# Altium schematic sheet MotorDriver.SchDoc
size A4; SheetNumber: 5; SheetTotal: 11
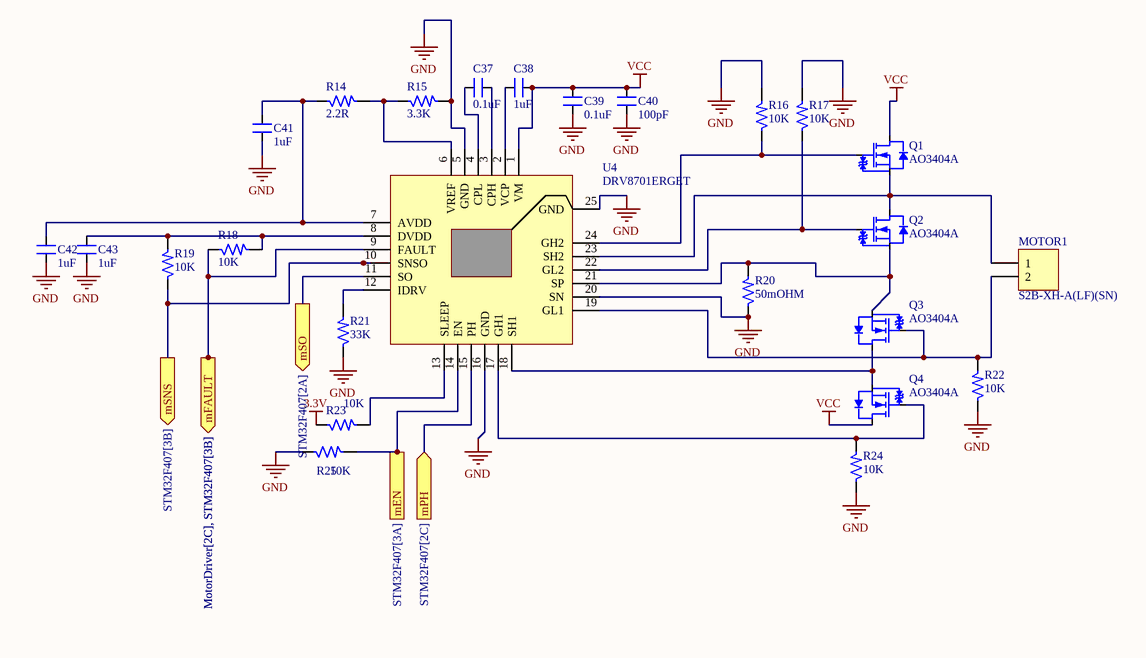
[diagram p0: MotorDriver.SchDoc]

## Parts
C37  0.1uF  [CAP_0805]
C38  1uF  [CAP_0805]
C39  0.1uF  [CAP_0805]
C40  100pF  [CAP_0805]
C41  1uF  [CAP_0805]
C42  1uF  [CAP_0805]
C43  1uF  [CAP_0805]
MOTOR1  S2B-XH-A(LF)(SN)  [CON2_100_S2B-XH-A_TH_RA]
Q1  AO3404A  [SOT 23-3]
Q2  AO3404A  [SOT 23-3]
Q3  AO3404A  [SOT 23-3]
Q4  AO3404A  [SOT 23-3]
R14  2.2R  [RES_0603]
R15  3.3K  [RES_0805]
R16  10K  [RES_0805]
R17  10K  [RES_0805]
R18  10K  [RES_0805]
R19  10K  [RES_0805]
R20  50mOHM  [RES_2512]
R21  33K  [RES_0805]
R22  10K  [RES_0805]
R23  10K  [RES_0805]
R24  10K  [RES_0805]
R25  10K  [RES_0805]
U4  DRV8701ERGET  [VFQFN24_19.6_196_12X32_SMD_1]

## Ports
mEN (in, see STM32F407[3A]), mFAULT (out, see MotorDriver[2C], STM32F407[3B]), mPH (in, see STM32F407[2C]), mSNS (out, see STM32F407[3B]), mSO (out, see STM32F407[2A])

## Nets
3.3V: R23.1
GND: C39.1 C40.1 C41.1 C42.1 C43.1 R15.2 R16.2 R17.2 R20.1 R21.1 R22.1 R24.1 R25.1 U4.5(GND) U4.16(GND) U4.20(SN) U4.25(GND)
VCC: C38.1 C39.2 C40.2 Q1.3(D) Q4.3(D) U4.1(VM)
mEN: R25.2 U4.14(EN) ; port mEN
mFAULT: R18.1 U4.9(FAULT) ; port mFAULT
mPH: U4.15(PH) ; port mPH
mSNS: R19.1 U4.10(SNSO) ; port mSNS
mSO: U4.11(SO) ; port mSO
NetC37_1: C37.1 U4.3(CPH)
NetC37_2: C37.2 U4.4(CPL)
NetC38_2: C38.2 U4.2(VCP)
NetC41_2: C41.2 C42.2 R14.1 U4.7(AVDD)
NetC43_2: C43.2 R18.2 R19.2 U4.8(DVDD)
NetMOTOR1_1: MOTOR1.1 Q1.2(S) Q2.3(D) U4.23(SH2)
NetMOTOR1_2: MOTOR1.2 Q3.1(G) R22.2 U4.19(GL1)
NetQ1_1: Q1.1(G) R16.1 U4.24(GH2)
NetQ2_1: Q2.1(G) R17.1 U4.22(GL2)
NetQ2_2: Q2.2(S) Q3.2(S) R20.2 U4.21(SP)
NetQ3_3: Q3.3(D) Q4.2(S) U4.18(SH1)
NetQ4_1: Q4.1(G) R24.2 U4.17(GH1)
NetR14_2: R14.2 R15.1 U4.6(VREF)
NetR21_2: R21.2 U4.12(IDRV)
NetR23_2: R23.2 U4.13(SLEEP)

## Library data of the parts
C37 C39 = CAP_0.1uF-50V-20%-0805: 0.1µF ±20% 50V Ceramic Capacitor X7R 0805 (2012 Metric); Manufacturer: Samsung Electro-Mechanics; Manufacturer Part Number: CL21B104MBCNNNC; Alternate Part Number-1: NA; Case/Package: 0805; Supplier-1: SIRICOM; Supplier Part Number-1: 0805B104K500CT
C38 C41-C43 = CAP_1uF-50V-5%-0805: 1µF ±5% 50V Ceramic Capacitor X7R 0805 (2012 Metric); Manufacturer: Samsung; Manufacturer Part Number: CC0805JKX7R9BB105; Alternate Part Number-1: 0805F105M500NT; Case/Package: 0805; Supplier-1: SIRICOM; Supplier Part Number-1: CL21B105KBFNNNE
C40 = CAP_100pF-100V-5%-0805: 100pF ±5% 100V Ceramic Capacitor C0G, NP0 0805 (2012 Metric); Manufacturer: Murata; Manufacturer Part Number: CL21C101JC61PNC; Alternate Part Number-1: NA; Case/Package: 0805; Supplier-1: SIRICOM; Supplier Part Number-1: 0805N101J101CT
MOTOR1 = CON-PLG_2X1-100-RA-TH: 2 Pins, 1 Row 2.54mm Pitch, right angle Connector, male; Manufacturer: JST; Mating Part Number: XHP-2; Crimp Part Number: ASXHSXH22K51; Alternate Part Number-1: NA; Manufacturer Part Number: S2B-XH-A(LF)(SN); Case/Package: TH-CON; Supplier-1: ARROW; Supplier Part Number-1: S2B-XH-A(LF)(SN)
Q1-Q4 = MOSFET-N_30V-5.8A-SOT23: N-Channel 30V 5.8A (Ta) 1.4W (Ta) Surface Mount SOT-23-3L; Manufacturer: International Rectifier; Alternate Part Number-1: PMV50ENEAR; Manufacturer Part Number: AO3404A; Case/Package: SOT23; Supplier-1: ARROW; Supplier Part Number-1: AO3404A
R14 = RES_2.2R-0.1W-1%-0603: 2.2 Ohms ±1% 0.1W, 1/10W Chip Resistor 0603 (1608 Metric) Automotive AEC-Q200, Current Sense Thick Film; Manufacturer: Panasonic Electronic Components; Manufacturer Part Number: ERJ-3RQF2R2V; Alternate Part Number-1: NA; Case/Package: 0603; Supplier-1: SIRICOM; Supplier Part Number-1: NA
R15 = RES_3.3K-0.125W-1%-0805: 3.3 kOhms ±1% 0.125W, 1/8W Chip Resistor 0805 (2012 Metric) Thick Film; Manufacturer: Panasonic; Manufacturer Part Number: 1623214-1; Alternate Part Number-1: 0805W8F3301T5E; Case/Package: 0805; Supplier-1: SIRICOM; Supplier Part Number-1: WR08X3301FTL
R16-R19 R22-R25 = RES_10K-0.125W-1%-0805: 10 kOhms ±1% 0.125W, 1/8W Chip Resistor 0805 (2012 Metric) Automotive AEC-Q200 Thick Film; Manufacturer: CTS; Manufacturer Part Number: WR08X1002FTL; Case/Package: 0805; Supplier-1: SIRICOM; Supplier Part Number-1: WR08X1002FTL; Alternate Part Number-1: WR08X1002FTL
R20 = RES_50mOhm-2W-1%-2512: 50 mOhms ±1% 2W Chip Resistor 2512 (6432 Metric) Automotive AEC-Q200, Current Sense, Moisture Resistant Metal Element; Manufacturer: Yageo; Manufacturer Part Number: PA2512FKF7W0R05E; Alternate Part Number-1: PMR100HZPFU5L00; Case/Package: 2512; Supplier-1: SIRICOM; Supplier Part Number-1: LR2512-22R060F1
R21 = RES_33K-0.125W-1%-0805: Thick Film Resistors - SMD 33KOhms 1/8W 150V33 kOhms ±1% 0.125W, 1/8W Chip Resistor 0805 (2012 Metric) Thick Film; Manufacturer: Vishay BCcomponents; Manufacturer Part Number: CRG0805F33K; Alternate Part Number-1: NA; Case/Package: 0805; Supplier-1: SIRICOM; Supplier Part Number-1: WR08X3302FTL
U4 = IC_DRV8701ERGET: Motor Driver Power MOSFET Parallel 24-VQFN (4x4); Manufacturer: Texas Instruments; Alternate Part Number-1: NA; Manufacturer Part Number: DRV8701ERGET; Case/Package: VFQFN24; Supplier-1: ARROW; Supplier Part Number-1: DRV8701ERGET